# EAGLE schematic i2c_lcd (EAGLE 6.3)
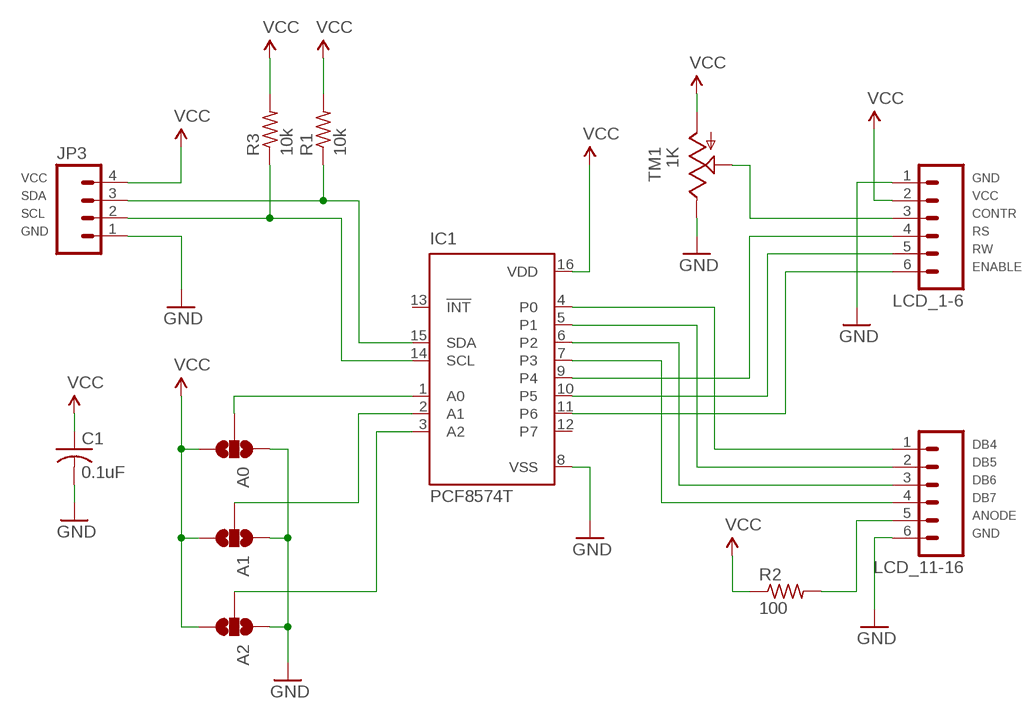
[diagram p0: schematic, sheet 1]

## Parts
A0  SOLDERJUMPER_2WAYT  [SJ_2]
A1  SOLDERJUMPER_2WAYT  [SJ_2]
A2  SOLDERJUMPER_2WAYT  [SJ_2]
C1  0.1uF  C-USC1206K  [C1206K]
IC1  PCF8574T  [SO16W]
JP3  M04PTH  [1X04]
LCD_1-6  M06SIP  [1X06]
LCD_11-16  M06SIP  [1X06]
R1  10k  R-US_R0805  [R0805]
R2  100  R-US_R0805  [R0805]
R3  10k  R-US_R0805  [R0805]
TM1  1K  TRIM  [6MM]

## Nets
A0: A0.2 IC1.1(A0)
A1: A1.2 IC1.2(A1)
A2: A2.2 IC1.3(A2)
ANODE: LCD_11-16.5 R2.2
CONTR: LCD_1-6.3 TM1.S
DB4: IC1.4(P0) LCD_11-16.1
DB5: IC1.5(P1) LCD_11-16.2
DB6: IC1.6(P2) LCD_11-16.3
DB7: IC1.7(P3) LCD_11-16.4
ENABLE: IC1.11(P6) LCD_1-6.6
GND: A0.1 A1.1 A2.1 C1.2 IC1.8(VSS) JP3.1 LCD_1-6.1 LCD_11-16.6 TM1.E
RS: IC1.9(P4) LCD_1-6.4
RW: IC1.10(P5) LCD_1-6.5
SCL: IC1.14(SCL) JP3.2 R3.1
SDA: IC1.15(SDA) JP3.3 R1.1
VCC: A0.3 A1.3 A2.3 C1.1 IC1.16(VDD) JP3.4 LCD_1-6.2 R1.2 R2.1 R3.2 TM1.A
Unconnected: IC1.12(P7) IC1.13(!INT)

## Library data of the parts
A0 A1 A2 = SparkFun:SOLDERJUMPER_2WAY: Solder Jumper 2 way solder jumper
C1 = adafruit:C-US: CAPACITOR, American symbol
IC1 = micro-philips:PCF8574: I2C-Bus Remote 8-bit I/O expander http://www.semiconductors.philips.com/acrobat_download/datasheets/PCF8574_4.pdf; MPN: PCF8574T/3,512; OC_FARNELL: 1201255; OC_NEWARK: 70R6870
JP3 = SparkFun-Connectors:M04: Header 4 Standard 4-pin 0.1" header. Use with straight break away headers (SKU : PRT-00116), right angle break away headers (PRT-00553), swiss pins (PRT-00743), machine pins (PRT-00117), and female headers (PRT-00115). Molex polarized connector foot print use with SKU : PRT-08231 with associated crimp pins and housings. 1MM SMD Version SKU: PRT-10208
LCD_1-6 LCD_11-16 = SparkFun-Connectors:M06: Header 6 Standard 6-pin 0.1" header. Use with straight break away headers (SKU : PRT-00116), right angle break away headers (PRT-00553), swiss pins (PRT-00743), machine pins (PRT-00117), and female headers (PRT-00115). Molex polarized connector foot print use with SKU : PRT-08094 with associated crimp pins and housings. NOTES ON THE VARIANTS LOCK and LOCK_LONGPADS... This footprint was designed to help hold the alignment of a through-hole component (i.e. 6-pin header) while soldering it into place. You may notice that each hole has been shifted either up or down by 0.005 of an inch from it's more standard position (which is a perfectly straight line). This slight alteration caused the pins (the squares in the middle) to touch the edges of the holes. Because they are alternating, it causes a "brace" to hold the component in place. 0.005 has proven to be the perfect amount of "off-center" position when using our standard breakaway headers. Although looks a little odd when you look at the bare footprint, once you have a header in there, the alteration is very hard to notice. Also, if you push a header all the way into place, it is covered up entirely on the bottom side. This idea of altering the position of holes to aid alignment will be further integrated into the Sparkfun Library for other footprints. It can help hold any component with 3 or more connection pins.
R1-R3 = adafruit:R-US_: RESISTOR, American symbol
TM1 = adafruit:TRIM